# EAGLE design motherboard (EAGLE 7.1.0)
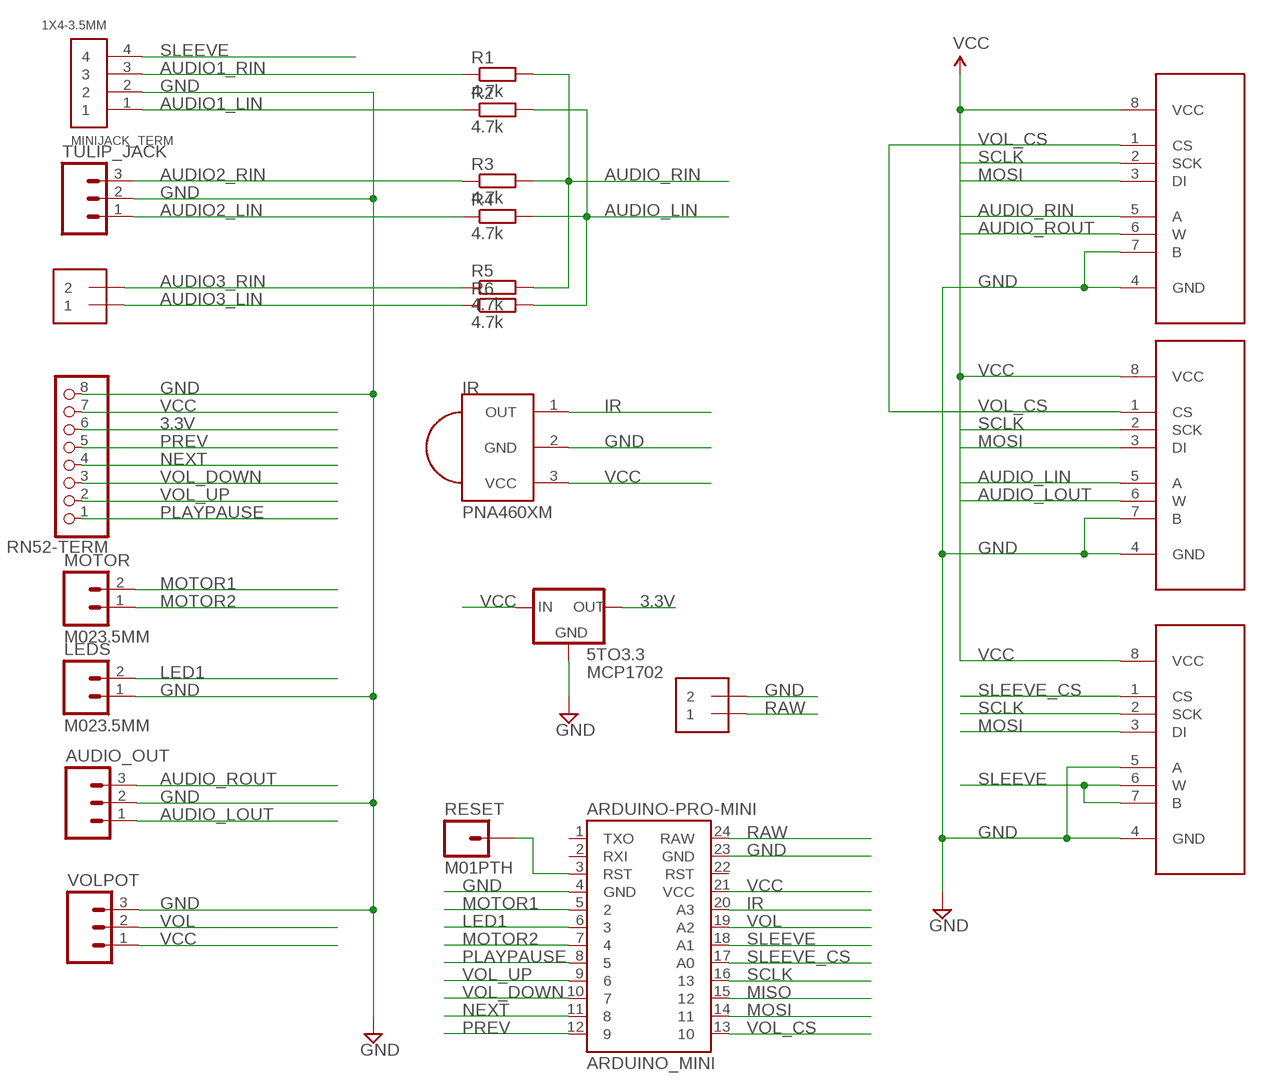
[diagram p0: schematic, sheet 1]

## Parts
5TO3.3  MCP1702  MCP1700INLINE  [TO92-INLINE]
ARDUINO-PRO-MINI  ARDUINO_MINI  [ARDUINO_MINI]
AUDIO_OUT  M03SCREW  [SCREWTERMINAL-3.5MM-3]
BL_AUDIO_TERM  1X2-3.5MM  [1X2-3.5MM]
DPOT_LFT  MCP41XXXDIL  [DIL-08]
DPOT_RGHT  MCP41XXXDIL  [DIL-08]
DPOT_SLEEVE  MCP41XXXDIL  [DIL-08]
IR  PNA460XM  [PNA460XM]
LEDS  M023.5MM  [SCREWTERMINAL-3.5MM-2]
MINIJACK_TERM  1X4-3.5MM  [1X04-3.5MM]
MOTOR  M023.5MM  [SCREWTERMINAL-3.5MM-2]
POWER  1X2-3.5MM  [1X2-3.5MM]
R1  4.7k  R-EU_0207/10  [0207/10]
R2  4.7k  R-EU_0207/10  [0207/10]
R3  4.7k  R-EU_0207/10  [0207/10]
R4  4.7k  R-EU_0207/10  [0207/10]
R5  4.7k  R-EU_0207/10  [0207/10]
R6  4.7k  R-EU_0207/10  [0207/10]
RESET  M01PTH  [1X01]
RN52-TERM  PINHD-1X8-3.5MM  [1X08-3.5MM]
TULIP_JACK  M03SCREW  [SCREWTERMINAL-3.5MM-3]
VOLPOT  M03SCREW  [SCREWTERMINAL-3.5MM-3]

## Nets
3.3V: 5TO3.3.3(OUT) RN52-TERM.6
AUDIO1_LIN: MINIJACK_TERM.1 R2.1
AUDIO1_RIN: MINIJACK_TERM.3 R1.1
AUDIO2_LIN: R4.1 TULIP_JACK.1
AUDIO2_RIN: R3.1 TULIP_JACK.3
AUDIO3_LIN: BL_AUDIO_TERM.1 R6.1
AUDIO3_RIN: BL_AUDIO_TERM.2 R5.1
AUDIO_LIN: DPOT_LFT.5(A) R2.2 R4.2 R6.2
AUDIO_LOUT: AUDIO_OUT.1 DPOT_LFT.6(W)
AUDIO_RIN: DPOT_RGHT.5(A) R1.2 R3.2 R5.2
AUDIO_ROUT: AUDIO_OUT.3 DPOT_RGHT.6(W)
GND: 5TO3.3.1(GND) ARDUINO-PRO-MINI.4(GND) ARDUINO-PRO-MINI.23(GND) AUDIO_OUT.2 DPOT_LFT.4(GND) DPOT_LFT.7(B) DPOT_RGHT.4(GND) DPOT_RGHT.7(B) DPOT_SLEEVE.4(GND) DPOT_SLEEVE.5(A) IR.2(GND) LEDS.1 MINIJACK_TERM.2 POWER.2 RN52-TERM.8 TULIP_JACK.2 VOLPOT.3
IR: ARDUINO-PRO-MINI.20(A3) IR.1(OUT)
LED1: ARDUINO-PRO-MINI.6 LEDS.2
MISO: ARDUINO-PRO-MINI.15
MOSI: ARDUINO-PRO-MINI.14 DPOT_LFT.3(DI) DPOT_RGHT.3(DI) DPOT_SLEEVE.3(DI)
MOTOR1: ARDUINO-PRO-MINI.5 MOTOR.2
MOTOR2: ARDUINO-PRO-MINI.7 MOTOR.1
N$2: ARDUINO-PRO-MINI.3(RST) RESET.1
NEXT: ARDUINO-PRO-MINI.11 RN52-TERM.4
PLAYPAUSE: ARDUINO-PRO-MINI.8 RN52-TERM.1
PREV: ARDUINO-PRO-MINI.12 RN52-TERM.5
RAW: ARDUINO-PRO-MINI.24(RAW) POWER.1
SCLK: ARDUINO-PRO-MINI.16 DPOT_LFT.2(SCK) DPOT_RGHT.2(SCK) DPOT_SLEEVE.2(SCK)
SLEEVE: ARDUINO-PRO-MINI.18(A1) DPOT_SLEEVE.6(W) DPOT_SLEEVE.7(B) MINIJACK_TERM.4
SLEEVE_CS: ARDUINO-PRO-MINI.17(A0) DPOT_SLEEVE.1(CS)
VCC: 5TO3.3.2(IN) ARDUINO-PRO-MINI.21(VCC) DPOT_LFT.8(VCC) DPOT_RGHT.8(VCC) DPOT_SLEEVE.8(VCC) IR.3(VCC) RN52-TERM.7 VOLPOT.1
VOL: ARDUINO-PRO-MINI.19(A2) VOLPOT.2
VOL_CS: ARDUINO-PRO-MINI.13 DPOT_LFT.1(CS) DPOT_RGHT.1(CS)
VOL_DOWN: ARDUINO-PRO-MINI.10 RN52-TERM.3
VOL_UP: ARDUINO-PRO-MINI.9 RN52-TERM.2
Unconnected: ARDUINO-PRO-MINI.1(TXO) ARDUINO-PRO-MINI.2(RXI) ARDUINO-PRO-MINI.22(RST)

## Library data of the parts
5TO3.3 = adafruit:MCP1700: VOLTAGE REGULATOR
ARDUINO-PRO-MINI = SparkFun-Boards:ARDUINO_MINI: Arduino Pro Mini footprint
AUDIO_OUT TULIP_JACK VOLPOT = SparkFun-Connectors:M03: Header 3 Standard 3-pin 0.1" header. Use with straight break away headers (SKU : PRT-00116), right angle break away headers (PRT-00553), swiss pins (PRT-00743), machine pins (PRT-00117), and female headers (PRT-00115). Molex polarized connector foot print use with SKU : PRT-08232 with associated crimp pins and housings.
BL_AUDIO_TERM POWER = adafruit:1X2: 3.5mm Terminal block http://www.ladyada.net/library/pcb/eaglelibrary.html
DPOT_LFT DPOT_RGHT DPOT_SLEEVE = SparkFun-AnalogIC:MCP41XXX: SPI controlled single digital potentiometer by Microchip PID: COM-10613
IR = adafruit:PNA460XM: IR 38KHz receiver PNA4602 and related receivers http://www.ladyada.net/library/pcb/eaglelibrary.html
LEDS MOTOR = SparkFun-Connectors:M02: Standard 2-pin 0.1" header. Use with - straight break away headers ( PRT-00116) - right angle break away headers (PRT-00553) - swiss pins (PRT-00743) - machine pins (PRT-00117) - female headers (PRT-00115) Molex polarized connector foot print use with: PRT-08233 with associated crimp pins and housings. 2.54_SCREWTERM for use with PRT-10571. 3.5mm Screw Terminal footprints for PRT-08084 5mm Screw Terminal footprints for use with PRT-08432
MINIJACK_TERM = adafruit:1X4: 4-pin connector
R1-R6 = rcl:R-EU_: RESISTOR, European symbol
RESET = SparkFun-Connectors:M01: Header 1 Standard 1-pin 0.1" header. Use with straight break away headers (SKU : PRT-00116), right angle break away headers (PRT-00553), swiss pins (PRT-00743), machine pins (PRT-00117), and female headers (PRT-00115).
RN52-TERM = adafruit:PINHD-1X8: PIN HEADER

## Board
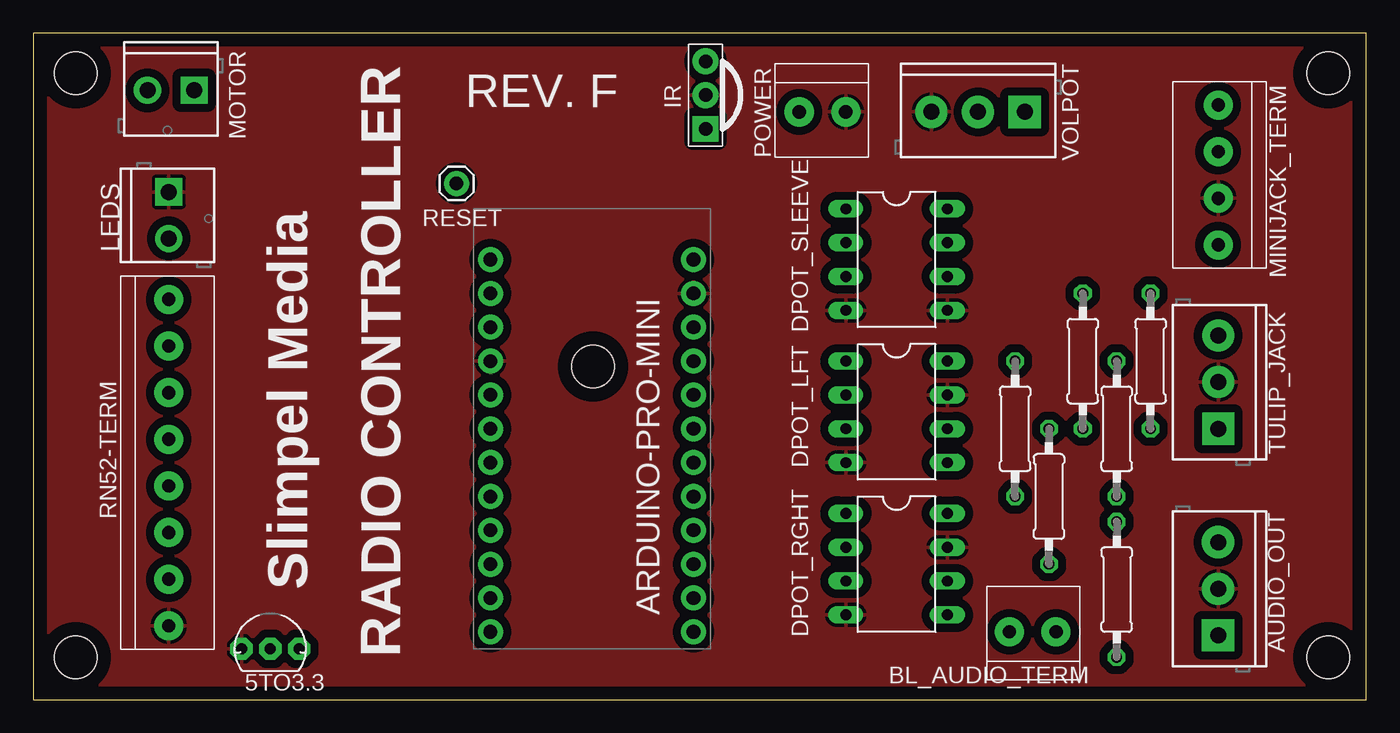
[diagram p1: board, top side]
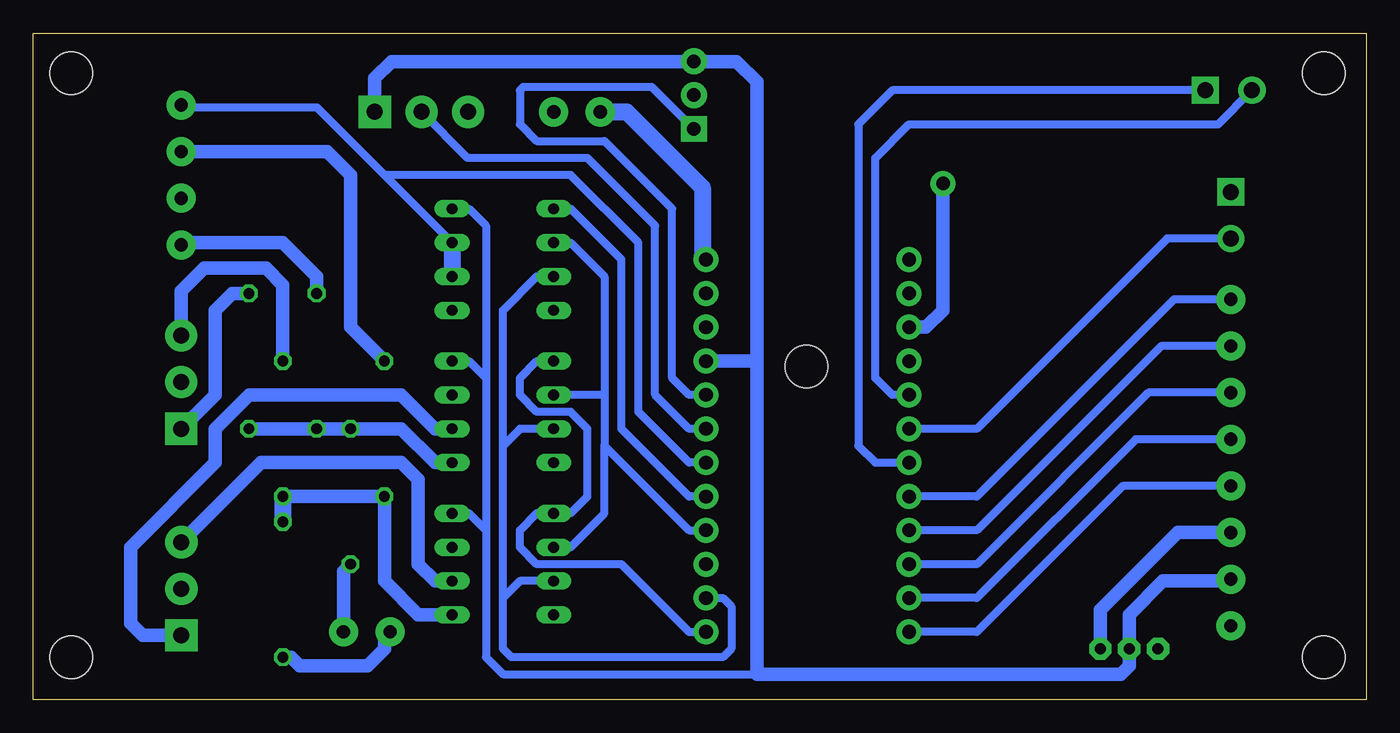
[diagram p2: board, bottom side, seen from below]

Size 100 x 50 mm. Coordinates in mm from the lower left corner, seen from the top.
Outline: 0,0 100,0 100,50 0,50 0,0
Copper layers (1*16): Top 0.035mm / dielectric 1.5mm / Bottom 0.035mm
Design rules "default *": minimum track width 10mil, minimum drill 24mil, track to track 0.5mm, track to pad 8mil, pad to pad 8mil, via to via 8mil, smd to smd 8mil, copper to edge 40mil, drill to drill 8mil, minimum pad ring 10mil, minimum via ring 8mil, stop-mask expansion 4mil, vias tented up to drill 0mil, thermal gap 10mil
Holes 3.2 mm at 3.17,46.99 3.17,3.17 97.16,46.99 97.16,3.17 42,25

### Footprints (pad centres in the part's own frame; a part is rotated, then mirrored left to right if it is on the bottom)
TO92-INLINE = drill 0.813 pad 1.676 octagon: 1 -2.159,0; 2 0,0; 3 2.159,0
ARDUINO_MINI = drill 1.016 pad 1.88: 1 -7.62,12.7; 2 -7.62,10.16; 3 -7.62,7.62; 4 -7.62,5.08; 5 -7.62,2.54; 6 -7.62,0; 7 -7.62,-2.54; 8 -7.62,-5.08; 9 -7.62,-7.62; 10 -7.62,-10.16; 11 -7.62,-12.7; 12 -7.62,-15.24; 13 7.62,-15.24; 14 7.62,-12.7; 15 7.62,-10.16; 16 7.62,-7.62; 17 7.62,-5.08; 18 7.62,-2.54; 19 7.62,0; 20 7.62,2.54; 21 7.62,5.08; 22 7.62,7.62; 23 7.62,10.16; 24 7.62,12.7
SCREWTERMINAL-3.5MM-3 = drill 1.2 pad 2.413 square: 1 0,0 | drill 1.2 pad 2.413: 2 3.5,0; 3 7,0
1X2-3.5MM = drill 1 pad 2.184: 1 1.8,0; 2 -1.7,0
DIL-08 = drill 0.813 long: 1 -3.81,-3.81; 2 -1.27,-3.81; 3 1.27,-3.81; 4 3.81,-3.81; 5 3.81,3.81; 6 1.27,3.81; 7 -1.27,3.81; 8 -3.81,3.81
PNA460XM = drill 1.016 pad 1.93 square: 1 -2.54,0 | drill 1.016 pad 1.93: 2 0,0; 3 2.54,0
SCREWTERMINAL-3.5MM-2 = drill 1.2 pad 2.032 square: 1 0,0 | drill 1.2 pad 2.032: 2 3.5,0
1X04-3.5MM = drill 1 pad 2.184: 1 -5.25,0; 2 -1.75,0; 3 1.75,0; 4 5.25,0
0207/10 = drill 0.813 octagon: 1 -5.08,0; 2 5.08,0
1X01 = drill 1.016 pad 1.88: 1 0,0
1X08-3.5MM = drill 1 pad 2.184: 1 -12.25,0; 2 -8.75,0; 3 -5.25,0; 4 -1.75,0; 5 1.75,0; 6 5.25,0; 7 8.75,0; 8 12.25,0

### Placement (x,y rotation side)
5TO3.3  17.78,3.81 0 top
ARDUINO-PRO-MINI  41.91,20.32 0 top
AUDIO_OUT  88.89,4.81 90 top
BL_AUDIO_TERM  74.93,5.08 0 top
DPOT_LFT  64.77,21.59 270 top
DPOT_RGHT  64.77,10.16 270 top
DPOT_SLEEVE  64.77,33.02 270 top
IR  50.44,45.36 90 top
LEDS  10.16,38.1 270 top
MINIJACK_TERM  88.9,39.37 90 top
MOTOR  12.06,45.72 180 top
POWER  59.26,44.1 180 top
R1  73.66,20.32 270 top
R2  78.74,25.4 270 top
R3  81.28,20.32 270 top
R4  83.82,25.4 270 top
R5  81.28,8.26 90 top
R6  76.2,15.24 90 top
RESET  31.75,38.73 0 top
RN52-TERM  10.16,17.78 270 top
TULIP_JACK  88.9,20.32 90 top
VOLPOT  74.38,44.1 180 top

### Tracks (layer width: path | path; a pad name or v marks a point on that pad's centre or on a via)
3.3V
  Bottom 1.016: RN52-TERM.6 14.14,12.53 19.94,6.73 5TO3.3.3
AUDIO1_LIN
  Bottom 1.016: R2.1 78.74,31.75 81.28,34.29 88.73,34.29 MINIJACK_TERM.1
AUDIO1_RIN
  Bottom 1.016: MINIJACK_TERM.3 77.95,41.12 76.2,39.37 76.2,27.94 R1.1
AUDIO2_LIN
  Bottom 1.016: R4.1 85.09,30.48 86.36,29.21 86.36,22.86 TULIP_JACK.1
AUDIO2_RIN
  Bottom 1.016: R3.1 81.28,31.11 82.55,32.38 87.17,32.38 88.9,30.65 TULIP_JACK.3
AUDIO3_LIN
  Bottom 1.016: R6.1 76.73,9.63 BL_AUDIO_TERM.1
AUDIO3_RIN
  Bottom 1.016: BL_AUDIO_TERM.2 73.66,4.65 73.66,3.81 74.93,2.54 80.01,2.54 80.64,3.17 R5.1
AUDIO_LIN
  Bottom 1.016: R4.2 R2.2 R6.2 72.39,20.32 69.85,17.78 DPOT_LFT.5
AUDIO_LOUT
  Bottom 1.016: DPOT_LFT.6 69.85,20.32 72.39,22.86 83.82,22.86 86.36,20.32 86.36,17.78 92.71,11.43 92.71,5.73 92.65,5.67 92.39,5.41 91.79,4.81 AUDIO_OUT.1
AUDIO_RIN
  Bottom 1.016: R3.2 R1.2 73.66,8.89 71.12,6.35 DPOT_RGHT.5
  Bottom 1.27: R3.2 R5.2
AUDIO_ROUT
  Bottom 1.016: DPOT_RGHT.6 69.85,8.89 71.12,10.16 71.12,16.51 72.39,17.78 82.92,17.78 AUDIO_OUT.3
GND
  pour Top (isolate 0.61): 0,49.53 0,0 100.33,0 100.16,49.53
IR
  Bottom 0.61: IR.1 53.61,45.99 63.23,45.99 63.5,45.72 63.5,43.18 62.23,41.91 57.15,41.91 52.07,36.83 52.07,24.13 50.8,22.86 ARDUINO-PRO-MINI.20
LED1
  Bottom 0.61: LEDS.2 14.93,34.6 29.21,20.32 ARDUINO-PRO-MINI.6
MOSI
  Bottom 0.61: 64.77,7.62 64.77,19.05 | DPOT_RGHT.3 63.5,8.89 64.77,7.62 | 64.77,7.62 64.77,3.81 64.14,3.17 48.26,3.17 47.62,3.81 47.62,6.99 48.26,7.62 ARDUINO-PRO-MINI.14 | DPOT_LFT.3 63.5,20.32 64.77,19.05 | 64.77,19.05 64.77,29.21 62.23,31.75 DPOT_SLEEVE.3
MOTOR1
  Bottom 0.61: ARDUINO-PRO-MINI.5 35.56,22.86 36.83,24.13 36.83,40.64 34.29,43.18 11.11,43.18 MOTOR.2
MOTOR2
  Bottom 0.61: MOTOR.1 35.56,45.72 38.1,43.18 38.1,19.05 36.83,17.78 ARDUINO-PRO-MINI.7
N$2
  Bottom 1.016: ARDUINO-PRO-MINI.3 33.02,27.94 31.75,29.21 RESET.1
NEXT
  Bottom 0.61: RN52-TERM.4 17.3,19.53 29.21,7.62 ARDUINO-PRO-MINI.11
PLAYPAUSE
  Bottom 0.61: RN52-TERM.1 14.42,30.03 29.21,15.24 ARDUINO-PRO-MINI.8
PREV
  Bottom 0.61: RN52-TERM.5 18.26,16.03 29.21,5.08 ARDUINO-PRO-MINI.12
RAW
  Bottom 1.27: POWER.1 55.48,44.1 49.81,38.43 49.81,33.3 ARDUINO-PRO-MINI.24
SCLK
  Bottom 0.61: ARDUINO-PRO-MINI.16 50.8,12.7 57.15,19.05 | 57.15,22.86 DPOT_LFT.2 | 57.15,19.05 57.15,13.97 59.69,11.43 DPOT_RGHT.2 | DPOT_SLEEVE.2 59.69,34.29 57.15,31.75 57.15,22.86 | 57.15,22.86 57.15,19.05
SLEEVE
  Bottom 0.61: MINIJACK_TERM.4 88.9,44.45 78.74,44.45 73.66,39.37 | ARDUINO-PRO-MINI.18 50.8,17.78 54.61,21.59 54.61,34.29 59.69,39.37 73.66,39.37 | DPOT_SLEEVE.7 73.66,39.37
  Bottom 1.27: DPOT_SLEEVE.7 DPOT_SLEEVE.6
SLEEVE_CS
  Bottom 0.61: 60.67,36.54 DPOT_SLEEVE.1 59.69,36.83 55.88,33.02 55.88,20.32 50.8,15.24 ARDUINO-PRO-MINI.17
VCC
  Bottom 0.61: DPOT_RGHT.8 67.31,13.97 66.04,12.7 | 66.04,12.7 66.04,3.17 64.77,1.91 45.72,1.91 | DPOT_LFT.8 67.31,25.4 66.04,24.13 | 66.04,24.13 66.04,12.7 | DPOT_SLEEVE.8 67.31,36.83 66.04,35.56 66.04,24.13
  Bottom 1.016: RN52-TERM.7 10.3,8.89 15.24,8.89 17.78,6.35 5TO3.3.2 17.78,2.54 18.41,1.91 45.72,1.91 45.72,25.4 | 49.18,25.2 49.33,25.2 ARDUINO-PRO-MINI.21 45.72,25.4 | VOLPOT.1 74.38,46.62 73.12,47.88 50.46,47.88 | 50.46,47.88 IR.3 | 45.72,25.4 45.72,46.35 47.24,47.88 50.46,47.88
VOL
  Bottom 0.61: 70.6,43.82 VOLPOT.2 67.42,40.64 58.42,40.64 53.34,35.56 53.34,22.86 50.8,20.32 ARDUINO-PRO-MINI.19
VOL_CS
  Bottom 0.61: ARDUINO-PRO-MINI.13 50.8,5.08 55.88,10.16 62.23,10.16 63.5,11.43 63.5,12.7 62.23,13.97 DPOT_RGHT.1 59.69,13.97 58.42,15.24 58.42,20.32 59.69,21.59 62.23,21.59 63.5,22.86 63.5,24.13 62.23,25.4 DPOT_LFT.1
VOL_DOWN
  Bottom 0.61: RN52-TERM.3 16.34,23.03 29.21,10.16 ARDUINO-PRO-MINI.10
VOL_UP
  Bottom 0.61: RN52-TERM.2 15.38,26.53 29.21,12.7 ARDUINO-PRO-MINI.9

### Text on the board
tNames: REV. F | Slimpel Media | RADIO CONTROLLER